# Altium schematic sheet Connector Section.SchDoc
size A; DocumentNumber: 5; SheetNumber: 2; SheetTotal: 30
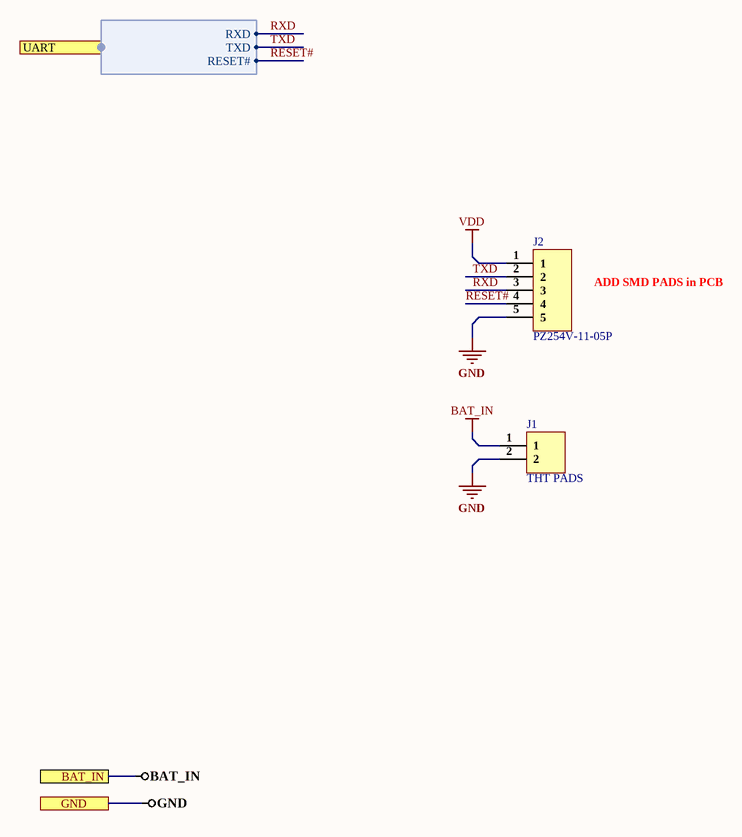
[diagram p0: Connector Section.SchDoc]

## Parts
J1  THT PADS  [THT PAD]
J2  PZ254V-11-05P  [PZ254V-11-05P]

## Ports
BAT_IN, GND, UART (harness Harness)

## Harnesses
Harness: RXD, TXD, RESET#

## Nets
BAT_IN: J1.1 ; port BAT_IN
GND: J1.2 J2.5 ; port GND
VDD: J2.1
RESET#: J2.4 ; port UART.RESET#
RXD: J2.3 ; port UART.RXD
TXD: J2.2 ; port UART.TXD

## Notes on the sheet
- ADD SMD PADS in PCB

## Library data of the parts
J1 = THT PAD
J2 = PZ254V-11-05P: Pin Header 5 1 right-angle; Manufacturer: XFCN; Brand Category: Made In Asia Brands; Pitch: 2.54; Packaging: Bag-packed; Connector Type: Pin Header; Number of Pins: 5; Number of Rows: 1